# Altium project Power_GOOD.PrjPcb
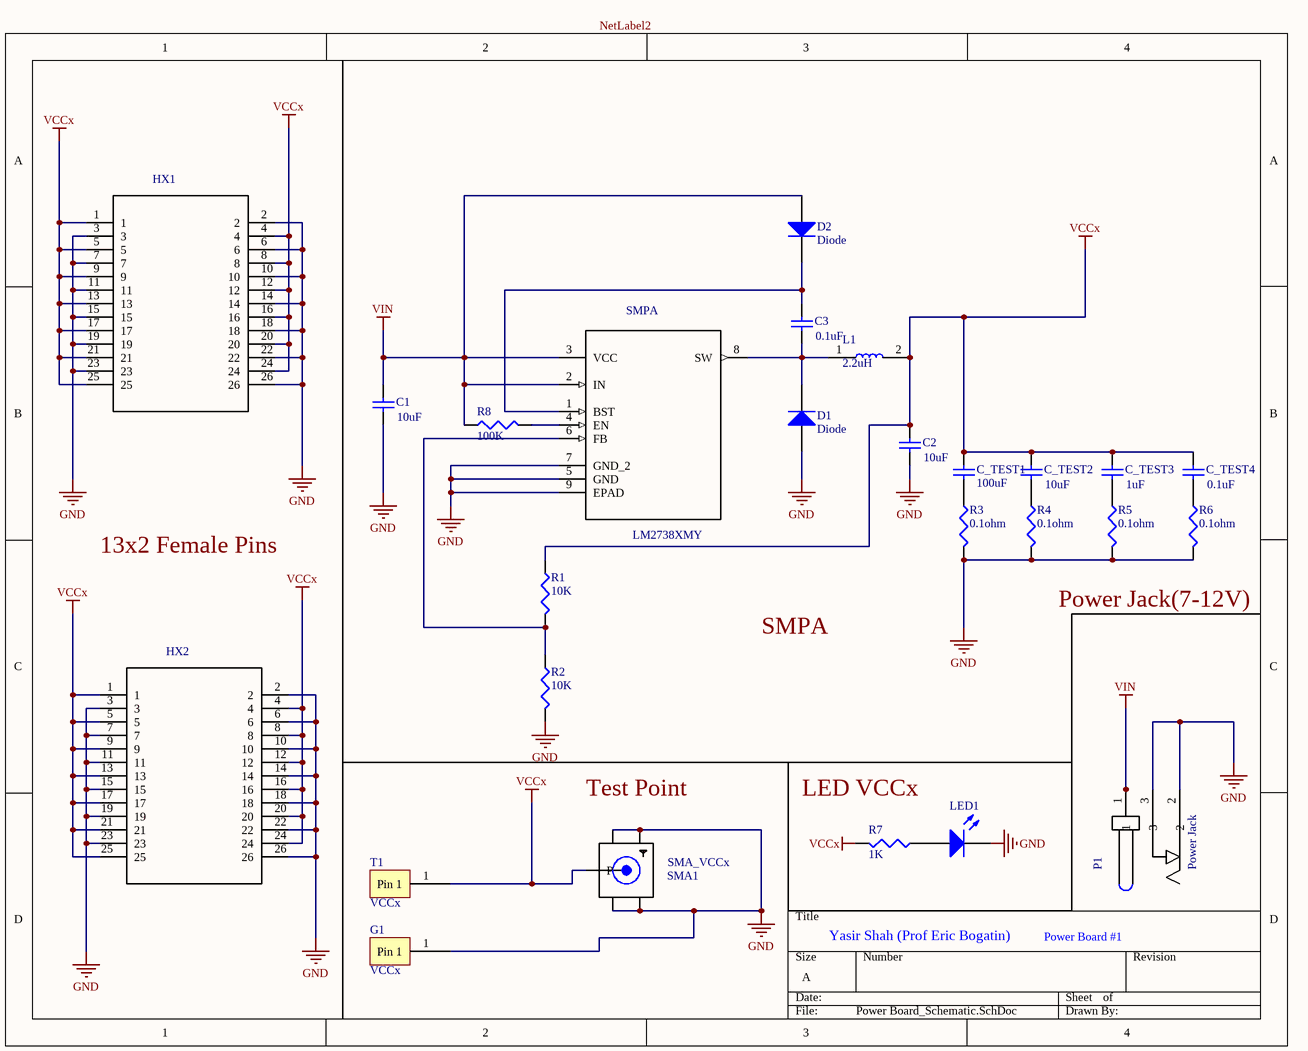
[diagram p0: Power Board_Schematic.SchDoc]
1 sheet, 26 parts. Net scope: global (net labels, ports and power ports of the same name join across sheets).
Board file: PCB_Good.PcbDoc

## Sheet Power Board_Schematic.SchDoc
size A

### Parts
C1  value 10uF  [CAPC2012X140N]  (hidden comment: Cap Semi)
C2  value 10uF  [CAPC2012X140N]  (hidden comment: Cap Semi)
C3  value 0.1uF  [CAPC2012X140N]  (hidden comment: Cap Semi)
C_TEST1  value 100uF  [CAPC2012X140N]  (hidden comment: Cap Semi)
C_TEST2  value 10uF  [CAPC2012X140N]  (hidden comment: Cap Semi)
C_TEST3  value 1uF  [CAPC2012X140N]  (hidden comment: Cap Semi)
C_TEST4  value 0.1uF  [CAPC2012X140N]  (hidden comment: Cap Semi)
D1  Diode  [D1]
D2  Diode  [d2]
G1  VCCx  [PCBComponent_1]
HX1  (no value)  [TYCO_1761606-9]
HX2  (no value)  [TYCO_1761606-9]
L1  2.2uH  [CAPC2012X140N]
LED1  LED2  [C1206]  (value not drawn)
P1  Power Jack  [CUI_PJ-002AH-SMT-TR]
R1  value 10K  [RESC2012X70]  (hidden comment: Res3)
R2  value 10K  [RESC2012X70]  (hidden comment: Res3)
R3  0.1ohm  [RESC3216X65]
R4  0.1ohm  [RESC3216X65]
R5  0.1ohm  [RESC3216X65]
R6  0.1ohm  [RESC3216X65]
R7  value 1K  [RESC2012X70]  (hidden comment: Res3)
R8  value 100K  [RESC2012X70]  (hidden comment: Res3)
SMA_VCCx  SMA1  [ADAFRUIT_1865_1865(Primary)]
SMPA  LM2738XMY  [SOP65P490X110-9N]
T1  VCCx  [PCBComponent_1]

### Nets
GND: C1.1 C2.1 D1.1(A) G1.1(Pin_1) HX1.2 HX1.3 HX1.6 HX1.7 HX1.10 HX1.11 HX1.14 HX1.15 HX1.18 HX1.19 HX1.22 HX1.23 HX1.26 HX2.2 HX2.3 HX2.6 HX2.7 HX2.10 HX2.11 HX2.14 HX2.15 HX2.18 HX2.19 HX2.22 HX2.23 HX2.26 LED1.2(K) P1.2 P1.3 R2.2 R3.2 R4.2 R5.2 R6.2 SMA_VCCx.GND1 SMA_VCCx.GND2 SMA_VCCx.GND3 SMA_VCCx.GND4 SMPA.5(GND) SMPA.7(GND_2) SMPA.9(EPAD)
VCCx: C2.2 C_TEST1.1 C_TEST2.2 C_TEST3.2 C_TEST4.2 HX1.1 HX1.4 HX1.5 HX1.8 HX1.9 HX1.12 HX1.13 HX1.16 HX1.17 HX1.20 HX1.21 HX1.24 HX1.25 HX2.1 HX2.4 HX2.5 HX2.8 HX2.9 HX2.12 HX2.13 HX2.16 HX2.17 HX2.20 HX2.21 HX2.24 HX2.25 L1.2 R1.1 R7.2 SMA_VCCx.P T1.1(Pin_1)
VIN: C1.2 D2.1(A) P1.1 R8.1 SMPA.2(IN) SMPA.3(VCC)
NetC3_1: C3.1 D1.2(K) L1.1 SMPA.8(SW)
NetC3_2: C3.2 D2.2(K) SMPA.1(BST)
NetC_TEST1_2: C_TEST1.2 R3.1
NetC_TEST2_1: C_TEST2.1 R4.1
NetC_TEST3_1: C_TEST3.1 R5.1
NetC_TEST4_1: C_TEST4.1 R6.1
NetLED1_1: LED1.1(A) R7.1
NetR1_2: R1.2 R2.1 SMPA.6(FB)
NetR8_2: R8.2 SMPA.4(EN)

### Notes on the sheet
- 13x2 Female Pins
- SMPA
- Power Jack(7-12V)
- (near SMA_VCCx) Test Point
- (near R7) LED VCCx
- Yasir Shah (Prof Eric Bogatin)
- Power Board #1
- Labels drawn without touching a wire or pin: NetLabel2

### Library data of the parts
C1-C3 C_TEST1-C_TEST4 = Cap Semi: Capacitor (Semiconductor SIM Model); Published: 8-Jun-2000; LatestRevisionDate: 29-May-2009; LatestRevisionNote: IPC-7351 Footprint Added.; PackageReference: C1206; Publisher: Altium Limited; PackageDescription: Chip Capacitor
D1 D2 = Diode: Default Diode; Published: 8-Jun-2000; LatestRevisionDate: 17-Jul-2002; LatestRevisionNote: Re-released for DXP Platform.; PackageVersion: Sep-1996; PackageReference: SMC; Publisher: Altium Limited; PackageDescription: DO-214-AB/SMC; 2 C-Bend Leads; Body 7.9 x 5.9 mm, inc. leads (LxW); Code_JEDEC: DO-214-AB
G1 T1 = 1Pin Header
HX1 HX2 = 1761606-9: Header, Pin, Idc, Amp-Latch, 26 Pos, Low Profile, Pcb, Vertical, Black; MF: TE Connectivity; Link: http://www.te.com/usa-en/product-1761606-9.html; Package: None; EU_RoHS_Compliance: Compliant; MP: 1761606-9; Availability: Good; Price: 4.02 USD; SnapEDA_Link: https://www.snapeda.com/symbols-footprints/1761606-9/TE%20Connectivity%20AMP%20Connectors/view-part/?ref=snap; Value: *
L1 = MLP2012H2R2MT0S1: Inductor Power Shielded Multi-Layer 2.2uH 20% 2MHz Ferrite 1A 195mOhm DCR 0805 Punched Paper T/R; MF: TDK; Availability: Good; Package: 0805 TDK; Price: 0.18 USD; SnapEDA_Link: https://www.snapeda.com/symbols-footprints/MLP2012H2R2MT0S1/TDK-Lambda%20Americas%20Inc/view-part/?ref=snap; MP: MLP2012H2R2MT0S1; Value: *
LED1 = LED2: Typical RED, GREEN, YELLOW, AMBER GaAs LED; Published: 8-Jun-2000; LatestRevisionDate: 17-Jul-2002; LatestRevisionNote: Re-released for DXP Platform.; PackageVersion: Feb-2002; PackageReference: 3.2X1.6X1.1; Publisher: Altium Limited; PackageDescription: SM LED; 2 Flat Leads
P1 = PJ-002AH-SMT-TR: 24 VDC 5 A Surface Mount Unshielded 2 Conductors 3 Contacts Male Power Jack; MF: CUI; Package: None; MP: PJ-002AH-SMT-TR; Availability: Good; Price: 1.03 USD; SnapEDA_Link: https://www.snapeda.com/symbols-footprints/PJ-002AH-SMT-TR/CUI%20Inc/view-part/?ref=snap; Value: *
R1-R8 = Res3: Resistor; Published: 8-Jun-2000; LatestRevisionDate: 29-May-2009; LatestRevisionNote: IPC-7351 Footprint Added.; PackageReference: J1-0603; Publisher: Altium Limited; PackageDescription: Chip Resistor
SMA_VCCx = 1865: Edge-Launch SMA Connector for 1.6mm / 0.062 Thick PCBs; MF: Keystone; Availability: Bad; SnapEDA_Link: https://www.snapeda.com/symbols-footprints/1865/Keystone%20Electronics/view-part/?ref=snap; Package: None; MP: 1865; Price: 2.38 USD; Value: *
SMPA = LM2738XMY: Swx Reg, Step d, Dc-Dc, 1.5a, 8soic; MF: Texas Instruments; Price: None; Availability: Unavailable; Package: SOIC-8 Texas Instruments; SnapEDA_Link: https://www.snapeda.com/symbols-footprints/LM2738XMY/Texas%20Instruments/view-part/?ref=snap; MP: LM2738XMY; Value: *